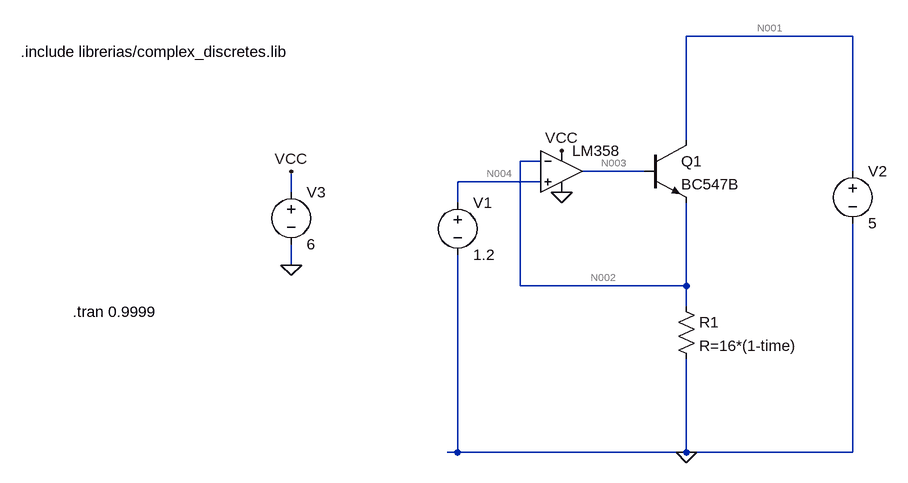
[diagram p0: schematic Draft1.asc]
Draft1.asc, the LTspice schematic file:
Version 4
SHEET 1 880 680
WIRE 560 -128 304 -128
WIRE 304 32 304 -128
WIRE 80 64 48 64
WIRE 240 80 144 80
WIRE 560 80 560 -128
WIRE 80 96 -48 96
WIRE -304 112 -304 80
WIRE -48 128 -48 96
WIRE -304 224 -304 192
WIRE 48 256 48 64
WIRE 304 256 304 128
WIRE 304 256 48 256
WIRE 304 288 304 256
WIRE -48 512 -48 208
WIRE -48 512 -64 512
WIRE 304 512 304 368
WIRE 304 512 -48 512
WIRE 560 512 560 160
WIRE 560 512 304 512
FLAG 112 112 0
FLAG -304 224 0
FLAG -304 80 VCC
FLAG 112 48 VCC
FLAG 304 512 0
SYMBOL voltage -48 112 R0
WINDOW 123 0 0 Left 0
WINDOW 39 0 0 Left 0
SYMATTR InstName V1
SYMATTR Value 1.2
SYMBOL voltage 560 64 R0
WINDOW 123 0 0 Left 0
WINDOW 39 0 0 Left 0
SYMATTR InstName V2
SYMATTR Value 5
SYMBOL res 288 272 R0
SYMATTR InstName R1
SYMATTR Value R=16*(1-time)
SYMBOL OpAmps\\UniversalOpAmp2 112 80 R0
SYMATTR InstName LM358
SYMBOL npn 240 32 R0
SYMATTR InstName Q1
SYMATTR Value BC547B
SYMBOL voltage -304 96 R0
WINDOW 123 0 0 Left 0
WINDOW 39 0 0 Left 0
SYMATTR InstName V3
SYMATTR Value 6
TEXT -640 296 Left 2 !.tran 0.9999
TEXT -720 -104 Left 2 !.include librerias/complex_discretes.lib

The netlist it stands for:
* Draft1.asc
V1 N004 0 1.2
V2 N001 0 5
R1 N002 0 R=16*(1-time)
XLM358 N004 N002 VCC 0 N003 level2 Avol=1Meg GBW=10Meg Slew=10Meg Ilimit=25m Rail=0 Vos=0 En=0 Enk=0 In=0 Ink=0 Rin=500Meg  ; pins In+ In- V+ V- OUT
Q1 N001 N003 N002 0 BC547B
V3 VCC 0 6
.model NPN NPN
.model PNP PNP
.lib standard.bjt
.tran 0.9999
.include librerias/complex_discretes.lib
.lib UniversalOpAmp2.lib
.backanno
.end

* Results of the author's LTspice run, read from the files saved beside the schematic
* Operating Point, zero values left out:
*   V(n004) = 1.2 V
*   V(n001) = 5 V
*   V(n002) = 1.2 V
*   V(n003) = 1.996 V
*   V(vcc) = 6 V
*   I(R1) = 75 mA
*   Ic(Q1) = 74.62 mA
*   Ib(Q1) = 384.7 µA
*   Ie(Q1) = -75 mA
*   I(V1) = 3.6 nA
*   I(V2) = -74.62 mA
*   I(V3) = -534.3 µA
*   Ix(lm358:1) = -3.6 nA
*   Ix(lm358:2) = -3.6 nA
*   Ix(lm358:3) = 534.3 µA
*   Ix(lm358:4) = -149.6 µA
*   Ix(lm358:5) = -384.7 µA
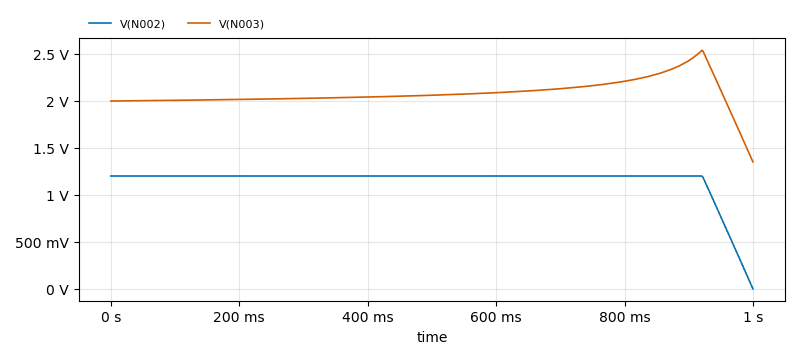
[diagram p1: Transient Analysis of Draft1.asc, plotted from the saved traces]
* Transient Analysis, 1 run:
*   V(N002): min 1.551 mV, max 1.2 V, average 1.153 V, rms 1.169 V, last 1.551 mV
*   V(N003): min 1.35 V, max 2.535 V, average 2.08 V, rms 2.086 V, last 1.35 V